# Altium schematic sheet FPGA_POWER_AND_CONFIGURATION.SchDoc: FPGA Configuration
size B; Engineer: M. Jones; Organization: Michael Jones; DocumentNumber: 3; Revision: RA.1; SheetNumber: 3; SheetTotal: 7
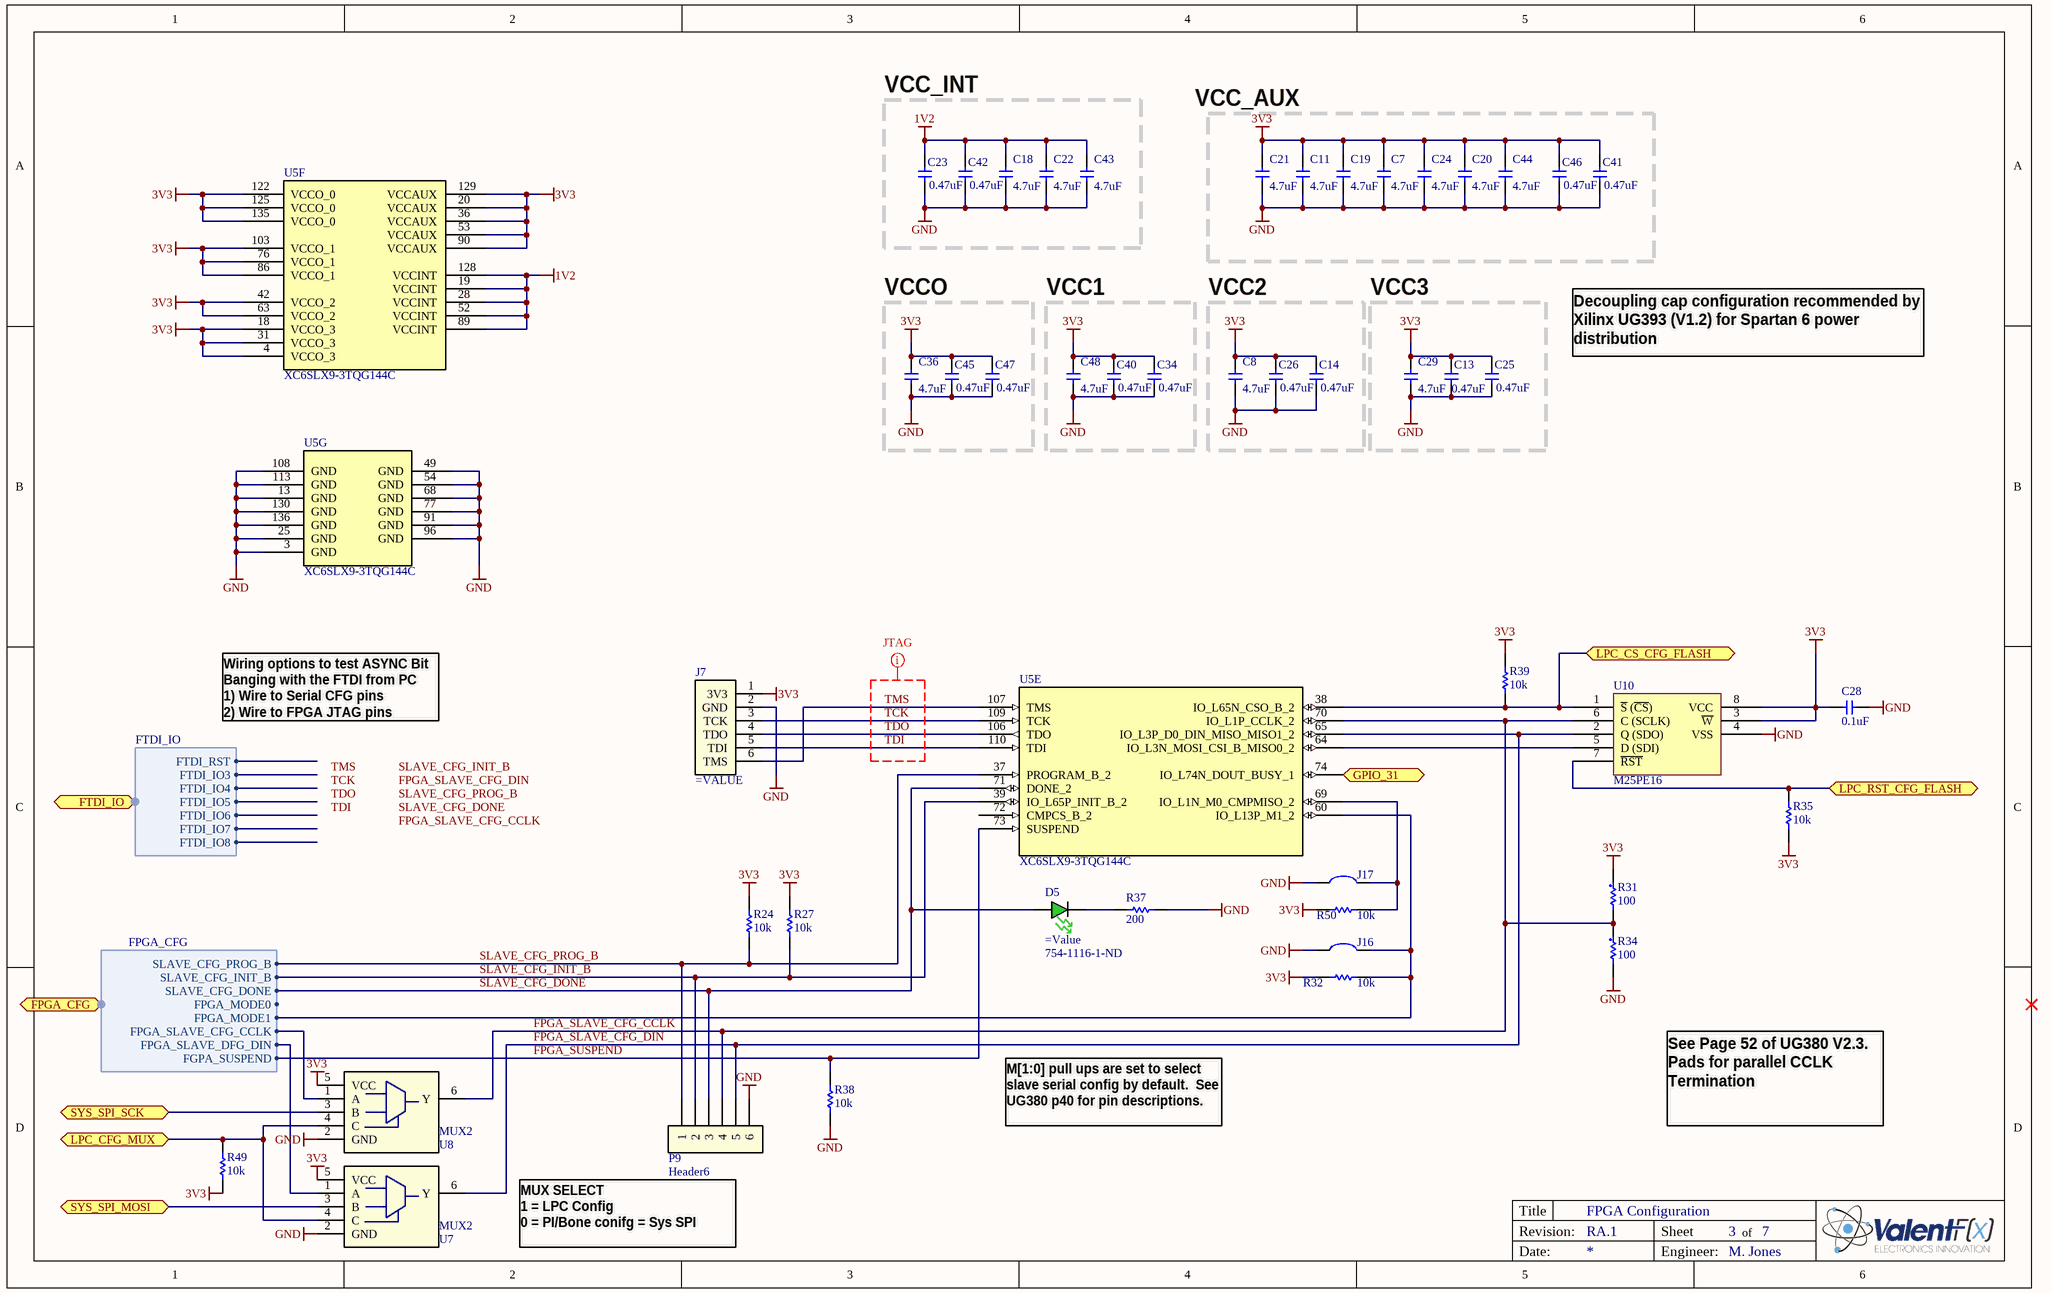
[diagram p0: FPGA_POWER_AND_CONFIGURATION.SchDoc]

## Parts
C7  4.7uF  [C0603]
C8  4.7uF  [C0603]
C11  4.7uF  [C0603]
C13  0.47uF  [C0603]
C14  0.47uF  [C0603]
C18  4.7uF  [C0603]
C19  4.7uF  [C0603]
C20  4.7uF  [C0603]
C21  4.7uF  [C0603]
C22  4.7uF  [C0603]
C23  0.47uF  [C0603]
C24  4.7uF  [C0603]
C25  0.47uF  [C0603]
C26  0.47uF  [C0603]
C28  0.1uF  [C0603]
C29  4.7uF  [C0603]
C34  0.47uF  [C0603]
C36  4.7uF  [C0603]
C40  0.47uF  [C0603]
C41  0.47uF  [C0603]
C42  0.47uF  [C0603]
C43  4.7uF  [C0603]
C44  4.7uF  [C0603]
C45  0.47uF  [C0603]
C46  0.47uF  [C0603]
C47  0.47uF  [C0603]
C48  4.7uF  [C0603]
D5  Supplier Part Number 1: 754-1116-1-ND  [LED_0603 - GREEN]
J7  (no value)  [JTAG - Digilent HS1]
J16  Solder Jumper  [SOLDER_JUMPER]  (value not drawn)  (no BOM)
J17  Solder Jumper  [SOLDER_JUMPER]  (value not drawn)  (no BOM)
P9  Header6  [HEADER_6_30_100 SMT SIP]
R24  10k  [R0603]
R27  10k  [R0603]
R31  100  [R0603]
R32  10k  [R0603]
R34  100  [R0603]
R35  10k  [R0603]
R37  200  [R0603]
R38  10k  [R0603]
R39  10k  [R0603]
R49  10k  [R0603]
R50  10k  [R0603]
U5  XC6SLX9-3TQG144C  [TQ144_L]  (parts E,F,G of 7)
U7  MUX2  [SC70-6]
U8  MUX2  [SC70-6]
U10  M25PE16  [SOIC127P830X200-8L]

## Blocks framed on the sheet
VCC_INT: C18 C22 C23 C42 C43
VCCO: C36 C45 C47
VCC1: C34 C40 C48
VCC2: C8 C14 C26
VCC3: C13 C25 C29

## Ports
FPGA_CFG (harness FPGA_CFG), FTDI_IO (harness FTDI_IO), GPIO_31, LPC_CFG_MUX, LPC_CS_CFG_FLASH, LPC_RST_CFG_FLASH, SYS_SPI_MOSI, SYS_SPI_SCK

## Harnesses
FPGA_CFG: SLAVE_CFG_PROG_B, SLAVE_CFG_INIT_B, SLAVE_CFG_DONE, FPGA_MODE0, FPGA_MODE1, FPGA_SLAVE_CFG_CCLK, FPGA_SLAVE_DFG_DIN, FGPA_SUSPEND
FTDI_IO: FTDI_IO3, FTDI_IO4, FTDI_IO5, FTDI_IO6, FTDI_IO7, FTDI_IO8, FTDI_RST

## Nets
1V2: C18.2 C22.2 C23.2 C42.2 C43.2 U5.19(VCCINT) U5.28(VCCINT) U5.52(VCCINT) U5.89(VCCINT) U5.128(VCCINT)
3V3: C7.2 C8.2 C11.2 C13.2 C14.2 C19.2 C20.2 C21.2 C24.2 C25.2 C26.2 C28.1 C29.2 C34.2 C36.2 C40.2 C41.2 C44.2 C45.2 C46.2 C47.2 C48.2 J7.1(3V3) R24.2 R27.2 R31.1 R32.1 R35.2 R39.2 R49.1 R50.1 U5.4(VCCO_3) U5.18(VCCO_3) U5.20(VCCAUX) U5.31(VCCO_3) U5.36(VCCAUX) U5.42(VCCO_2) U5.53(VCCAUX) U5.63(VCCO_2) U5.76(VCCO_1) U5.86(VCCO_1) U5.90(VCCAUX) U5.103(VCCO_1) U5.122(VCCO_0) U5.125(VCCO_0) U5.129(VCCAUX) U5.135(VCCO_0) U7.5(VCC) U8.5(VCC) U10.3(~{W}) U10.8(VCC)
GND: C7.1 C8.1 C11.1 C13.1 C14.1 C18.1 C19.1 C20.1 C21.1 C22.1 C23.1 C24.1 C25.1 C26.1 C28.2 C29.1 C34.1 C36.1 C40.1 C41.1 C42.1 C43.1 C44.1 C45.1 C46.1 C47.1 C48.1 J7.2(GND) J16.2 J17.2 P9.6 R34.2 R37.2 R38.1 U5.3(GND) U5.13(GND) U5.25(GND) U5.49(GND) U5.54(GND) U5.68(GND) U5.77(GND) U5.91(GND) U5.96(GND) U5.108(GND) U5.113(GND) U5.130(GND) U5.136(GND) U7.2(GND) U8.2(GND) U10.4(VSS)
FPGA_SLAVE_CFG_CCLK: P9.4 R31.2 R34.1 U5.70(IO_L1P_CCLK_2) U8.6(Y) U10.6(C_(SCLK))
FPGA_SLAVE_CFG_DIN: P9.5 U5.65(IO_L3P_D0_DIN_MISO_MISO1_2) U7.6(Y) U10.2(Q_(SDO))
FPGA_SUSPEND: R38.2 U5.73(SUSPEND) ; port FPGA_CFG.FGPA_SUSPEND
GPIO_31: U5.74(IO_L74N_DOUT_BUSY_1) ; port GPIO_31
LPC_CFG_MUX: R49.2 U7.4(C) U8.4(C) ; port LPC_CFG_MUX
LPC_CS_CFG_FLASH: R39.1 U5.38(IO_L65N_CSO_B_2) U10.1(~{S}_(~{CS})) ; port LPC_CS_CFG_FLASH
LPC_RST_CFG_FLASH: R35.1 U10.7(~{RST}) ; port LPC_RST_CFG_FLASH
SLAVE_CFG_DONE: D5.A P9.3 U5.71(DONE_2) ; port FPGA_CFG.SLAVE_CFG_DONE
SLAVE_CFG_INIT_B: P9.2 R27.1 U5.39(IO_L65P_INIT_B_2) ; port FPGA_CFG.SLAVE_CFG_INIT_B
SLAVE_CFG_PROG_B: P9.1 R24.1 U5.37(PROGRAM_B_2) ; port FPGA_CFG.SLAVE_CFG_PROG_B
SYS_SPI_MOSI: U7.3(B) ; port SYS_SPI_MOSI
SYS_SPI_SCK: U8.3(B) ; port SYS_SPI_SCK
TCK: J7.3(TCK) U5.109(TCK)
TDI: J7.5(TDI) U5.110(TDI)
TDO: J7.4(TDO) U5.106(TDO)
TMS: J7.6(TMS) U5.107(TMS)
NetD5_C: D5.C R37.1
NetJ16_1: J16.1 R32.2 U5.60(IO_L13P_M1_2) ; port FPGA_CFG.FPGA_MODE1
NetJ17_1: J17.1 R50.2 U5.69(IO_L1N_M0_CMPMISO_2)
NetU5_64: U5.64(IO_L3N_MOSI_CSI_B_MISO0_2) U10.5(D_(SDI))
NetU7_1: U7.1(A) ; port FPGA_CFG.FPGA_SLAVE_DFG_DIN
NetU8_1: U8.1(A) ; port FPGA_CFG.FPGA_SLAVE_CFG_CCLK

Not connected (* = marked no-connect by the designer): U5 72(CMPCS_B_2)

## Layout directives
net class JTAG: TCK, TDI, TDO, TMS

## Notes on the sheet
- VCC_AUX
- Decoupling cap configuration recommended by Xilinx UG393 (V1.2) for Spartan 6 power distribution
- Wiring options to test ASYNC Bit Banging with the FTDI from PC
  1) Wire to Serial CFG pins
  2) Wire to FPGA JTAG pins
- M[1:0] pull ups are set to select slave serial config by default.  See UG380 p40 for pin descriptions.
- See Page 52 of UG380 V2.3.   Pads for parallel CCLK Termination
- MUX SELECT
  1 = LPC Config
  0 = PI/Bone conifg = Sys SPI
- Labels drawn without touching a wire or pin: FPGA_SLAVE_CFG_CCLK, FPGA_SLAVE_CFG_DIN, SLAVE_CFG_DONE, SLAVE_CFG_INIT_B, SLAVE_CFG_PROG_B, TCK, TDI, TDO, TMS
- Title
- Revision:
- Sheet
- of
- Date:
- Engineer:

## Library data of the parts
C7 C8 C11 C18-C22 C24 C29 C36 C43 C44 C48 = GRM188R60J475KE19D: CAP CER 4.7UF 6.3V X5R 0603; Manufacturer: Murata Electronics North America; Capacitance: 4.7µF; Tolerance: ±10%; Supplier 1: Digi-Key; Supplier Part Number 1: 490-3297-1-ND; Manufacturer Part Number: GRM188R60J475KE19D; RoHS: RoHS Compliant; Category: Capacitors; Stock 1: 714091; Pricing 1: 10=0.214, 50=0.148, 100=0.1142, 250=0.08204, 500=0.0585, 1000=0.04281 (USD); Voltage - Rated: 6.3V; Temperature Coefficient: X5R; Mounting Type: Surface Mount, MLCC; Operating Temperature: -55°C ~ 85°C; Applications: General Purpose; Ratings: -; Package / Case: 0603 (1608 Metric); Size / Dimension: 0.063" L x 0.031" W (1.60mm x 0.80mm); Height: -; Thickness: 0.035" (0.90mm); Lead Spacing: -; Features: -; Packaging: Cut Tape (CT); Lead Style: -; ComponentLink1URL: http://search.murata.co.jp/Ceramy/image/img/PDF/ENG/GRM188R60J475KE19.pdf; ComponentLink1Description: http://search.murata.co.jp/Ceramy/image/img/PDF/ENG/GRM188R60J475KE19.pdf; Value: 4.7uF
C13 C14 C23 C25 C26 C34 C40-C42 C45-C47 = GCM188R71E474KA64D: CAP CER .47UF 25V X7R 0603; Manufacturer: Murata Electronics North America; Capacitance: 0.47µF; Tolerance: ±10%; Supplier 1: Digi-Key; Supplier Part Number 1: 490-4776-1-ND; Manufacturer Part Number: GCM188R71E474KA64D; RoHS: RoHS Compliant; Category: Capacitors; Stock 1: 120782; Pricing 1: 10=0.248, 50=0.1444, 100=0.1155, 250=0.08252, 500=0.0561, 1000=0.04538 (USD); Voltage - Rated: 25V; Temperature Coefficient: X7R; Mounting Type: Surface Mount, MLCC; Operating Temperature: -55°C ~ 125°C; Applications: Automotive; Ratings: AEC-Q200; Package / Case: 0603 (1608 Metric); Size / Dimension: 0.063" L x 0.031" W (1.60mm x 0.80mm); Height: -; Thickness: 0.035" (0.90mm); Lead Spacing: -; Features: -; Packaging: Cut Tape (CT); Lead Style: -; ComponentLink1URL: http://search.murata.co.jp/Ceramy/image/img/PDF/ENG/GCM188R71E474KA64.pdf; ComponentLink1Description: http://search.murata.co.jp/Ceramy/image/img/PDF/ENG/GCM188R71E474KA64.pdf; Value: 0.47uF
C28 = GRM188R71H104KA93D: CAP CER .1UF 50V 10% X7R 0603; Manufacturer: Murata Electronics North America; Capacitance: 0.1µF; Manufacturer Part Number: GRM188R71H104KA93D; Value: CAP CER .1UF 50V 10% X7R 0603; Supplier 1: Digi-Key; Supplier Part Number 1: 490-1519-1-ND; RoHS: RoHS Compliant; Category: Capacitors; Stock 1: 9370695; Pricing 1: 10=0.037, 100=0.0221, 500=0.01276, 1000=0.00884 (USD); Voltage - Rated: 50V; Tolerance: ±10%; Temperature Coefficient: X7R; Mounting Type: Surface Mount, MLCC; Operating Temperature: -55°C ~ 125°C; Features: -; Applications: General Purpose; Ratings: -; Package / Case: 0603 (1608 Metric); Size / Dimension: 0.063" L x 0.031" W (1.60mm x 0.80mm); Lead Spacing: -; Thickness: 0.80mm; Packaging: Cut Tape (CT); Lead Style: -; ComponentLink1URL: http://search.murata.co.jp/Ceramy/image/img/PDF/ENG/GRM188R71H104KA93.pdf; ComponentLink1Description: http://search.murata.co.jp/Ceramy/image/img/PDF/ENG/GRM188R71H104KA93.pdf
D5 = APT1608CGCK: LED 1.6X0.8MM 570NM GRN CLR SMD; Manufacturer: Kingbright Corp; Color: Green; Current - Test: 20mA; Wavelength - Peak: 574nm; Millicandela Rating: 50mcd; Voltage - Forward (Vf) Typ: 2.1V; Lens Type: Clear; Lens Style/Size: Rectangle with Flat Top, 1.2mm x 0.8mm; Viewing Angle: 120°; Supplier 1: Digi-Key; Manufacturer Part Number: APT1608CGCK; RoHS: RoHS Compliant; Category: Optoelectronics; Stock 1: 98122; Pricing 1: 1=0.2, 10=0.153, 25=0.1224, 100=0.1105, 250=0.102, 500=0.0918 (USD); Luminous Flux @ Current - Test: -; Wavelength - Dominant: 570nm; Size / Dimension: 1.60mm L x 0.80mm W; Height: 0.75mm; Package / Case: 0603 (1608 Metric); Mounting Type: Surface Mount; Packaging: Cut Tape (CT); ComponentLink1URL: http://www.us.kingbright.com/images/catalog/SPEC/APT1608CGCK.pdf; ComponentLink1Description: http://www.us.kingbright.com/images/catalog/SPEC/APT1608CGCK.pdf
J7 = JTAG - Digilent HS1: DIGILENT - 410-205 - PROGRAMMING CABLE, JTAG HS1, USB2; Manufacturer: Samtec; Manufacturer Part Number: TSW-106-08-G-S-RA; Description: Conn Unshrouded Header HDR 6 POS 2.54mm Solder RA Thru-Hole; Lead Time: 0 weeks; Peak Solder Temperature: 260 deg C; MSL Level Min: N/R; Connector Type: Header, Unshrouded; Number of Positions: 6; Number of Positions Loaded: All; Pitch: 0.100" (2.54mm); Supplier 1: Arrow; RoHS: CHINA ROHS: Compliant / EU ROHS: Compliant; Stock 1: 0; Pricing 1: 0=0.2649 (USD); ComponentLink1URL: http://components.arrow.com/partservice/dataview/altium/2677508S3639200N1004?apiKey=aa438727d59eed98c4bed826d8d949c84cb5e685b92bf87346a0226bd2658797; ComponentLink1Description: http://components.arrow.com/partservice/dataview/altium/2677508S3639200N1004?apiKey=aa438727d59eed98c4bed826d8d949c84cb5e685b92bf87346a0226bd2658797; Supplier Part Number 1: 2677508S3639200N1004; Package Quantity: 1; Termination Finish: Au/Ni; MSL Level Max: N/R; MSL (Moisture Sensitivity Level): N/R; China ROHS Lead (X -> above / O -> below threshold): O; China ROHS Mercury (X -> above / O -> below threshold): O; China ROHS Cadmium (X -> above / O -> below threshold): O; China ROHS Hex Chromium (X -> above / O -> below threshold): O; China ROHS PBB (X -> above / O -> below threshold): O; China ROHS PBDE (X -> above / O -> below threshold): O; EU_ROHS_PROD_EXEMPTION_BY_SUPP: N/R; Supplier 2: Digi-Key; Category: Connectors, Interconnects; Stock 2: 0; Pricing 2: 1=0.94, 10=0.841, 100=0.6926, 500=0.5475, 1000=0.46999, 5000=0.42877, 10000=0.41228 (USD); Contact Type: Male Pin; Number of Rows: 1; Row Spacing: -; Contact Mating Length: 0.230" (5.84mm); Mounting Type: Through Hole; Termination: Solder; Fastening Type: -; Features: -; Contact Finish: Gold; Contact Finish Thickness: 10µin (0.25µm); Color: Black; Packaging: Bulk; ComponentLink2URL: http://www.samtec.com/documents/webfiles/cpdf/TSW-XXX-XX-XXX-X-XX-XXX-MKT.pdf; ComponentLink2Description: http://www.samtec.com/documents/webfiles/cpdf/TSW-XXX-XX-XXX-X-XX-XXX-MKT.pdf; Supplier Part Number 2: SAM1038-06-ND
J16 J17 = Solder Jumper: Solder/Configuration Jumper; Manufacturer: n/a; Manufacturer Part Number: n/a; Source: n/a; Source Part Number: n/a; ROHS Certificate: n/a
P9 = Header6: Header 6 pin
R24 R27 R32 R35 R38 R39 R49 R50 = ERJ-3EKF1002V: RES 10.0K OHM 1/10W 1% 0603 SMD; Manufacturer: Panasonic - ECG; Power (Watts): 0.1W, 1/10W; Temperature Coefficient: ±100ppm/°C; Manufacturer Part Number: ERJ-3EKF1002V; Value: 10k; Supplier 1: Digi-Key; RoHS: RoHS Compliant; Category: Resistors; Stock 1: 11168880; Pricing 1: 1=0.04, 50=0.015, 100=0.0114, 250=0.00844, 500=0.00624, 1000=0.00416 (USD); Resistance (Ohms): 10.0K; Composition: Thick Film; Features: -; Tolerance: ±1%; Size / Dimension: 0.063" L x 0.031" W (1.60mm x 0.80mm); Height: 0.018" (0.45mm); Lead Style: Surface Mount (SMD - SMT); Packaging: Cut Tape (CT); Package / Case: 0603 (1608 Metric); ComponentLink1URL: http://industrial.panasonic.com/www-cgi/jvcr13pz.cgi?E+PZ+3+AOA0002+ERJ3EKF1002V+7+WW; ComponentLink1Description: http://industrial.panasonic.com/www-cgi/jvcr13pz.cgi?E+PZ+3+AOA0002+ERJ3EKF1002V+7+WW; Supplier Part Number 1: P10.0KHCT-ND
R31 R34 = R0603 - CRCW0603100RFKEA: 100 ohms 1% Thick Film Resistors - SMD 1/10watt; Manufacturer: Vishay/Dale; Description: Thick Film Resistors - SMD 1/10watt 100ohms 1%; Power Rating: 0.1 Watt (1/10 Watt); Temperature Coefficient: 100 PPM / K; Voltage Rating: 75 Volts; Supplier 1: Mouser; Manufacturer Part Number: CRCW0603100RFKEA; RoHS: RoHS Compliant By Exemption; Category: Thick Film Resistors - SMD; Stock 1: 243353; Pricing 1: 1=0.108, 25=0.054, 100=0.034, 1000=0.020, 2000=0.018, 5000=0.008, 10000=0.007, 50000=0.005 (AUD); Dimensions: 0.85 mm W x 1.55 mm L x 0.45 mm H; Operating Temperature Range: - 55 C to + 155 C; Package / Case: 0603 (1608 metric); Packaging: Reel; Product: Thick Film Resistors SMD; Resistance: 100 Ohms; Series: CRCW; Termination Style: SMD/SMT; Tolerance: 1 %; Product Category: 0603 Thick Film Chip Resistors; Standard Pack Qty: 5000; RoHS - Mouser: E; Minimum Order Quantity: 1; Reeling: True; ComponentLink1URL: http://www.vishay.com/doc?20035; ComponentLink1Description: http://www.vishay.com/doc?20035; Supplier Part Number 1: 71-CRCW0603-100-E3; Value: 100
R37 = ERJ-3EKF2000V: RES 200 OHM 1/10W 1% 0603 SMD; Manufacturer: Panasonic - ECG; Power (Watts): 0.1W, 1/10W; Temperature Coefficient: ±100ppm/°C; Manufacturer Part Number: ERJ-3EKF2000V; Value: RES 200 OHM 1/10W 1% 0603 SMD; Supplier 1: Digi-Key; Supplier Part Number 1: P200HCT-ND; RoHS: RoHS Compliant; Category: Resistors; Stock 1: 1279595; Pricing 1: 1=0.04, 50=0.015, 100=0.0114, 250=0.00844, 500=0.00624, 1000=0.00416 (USD); Resistance (Ohms): 200; Composition: Thick Film; Features: -; Tolerance: ±1%; Size / Dimension: 0.063" L x 0.031" W (1.60mm x 0.80mm); Height: 0.018" (0.45mm); Lead Style: Surface Mount (SMD - SMT); Packaging: Cut Tape (CT); Package / Case: 0603 (1608 Metric); ComponentLink1URL: http://industrial.panasonic.com/www-cgi/jvcr13pz.cgi?E+PZ+3+AOA0002+ERJ3EKF2000V+7+WW; ComponentLink1Description: http://industrial.panasonic.com/www-cgi/jvcr13pz.cgi?E+PZ+3+AOA0002+ERJ3EKF2000V+7+WW
U5 = XC6SLX9-3TQG144C: IC FPAG SPARTAN 6 9K 144TQFP; Manufacturer: Xilinx Inc; Number of Logic Elements/Cells: 9152; Number of LABs/CLBs: 715; Total RAM Bits: 589824; Number of I /O: 102; Voltage - Supply: 1.14 V ~ 1.26 V; Supplier 1: Digi-Key; Supplier Part Number 1: 122-1747-ND; Manufacturer Part Number: XC6SLX9-3TQG144C; RoHS: RoHS Compliant; Category: Integrated Circuits (ICs); Stock 1: 77; Pricing 1: 1=17.22 (USD); Number of Gates: -; Mounting Type: Surface Mount; Operating Temperature: 0°C ~ 85°C; Package / Case: 144-LQFP; Supplier Device Package: 144-TQFP (20x20); ComponentLink1URL: http://www.xilinx.com/support/documentation/data_sheets/ds160.pdf; ComponentLink1Description: http://www.xilinx.com/support/documentation/data_sheets/ds160.pdf; Value: XC6SLX9-3TQG144C
U7 U8 = MUX - SN74AUP1T157DCKR: IC BUFF/MUX SCHMITT-TRIG SC70-6; Manufacturer: Texas Instruments; Circuit: 1 x 3:1; Independent Circuits: 1; Current - Output High, Low: 4mA, 4mA; Voltage Supply Source: Single Supply; Voltage - Supply: 2.3 V ~ 3.6 V; Supplier 1: Digi-Key; Manufacturer Part Number: SN74AUP1T157DCKR; RoHS: RoHS Compliant; Category: Integrated Circuits (ICs); Stock 1: 1261; Pricing 1: 1=0.4, 10=0.315, 25=0.266, 100=0.2166, 250=0.1794, 500=0.1482, 1000=0.111 (USD); Type: Multiplexer; Operating Temperature: -40°C ~ 85°C; Mounting Type: Surface Mount; Package / Case: 6-TSSOP, SC-88, SOT-363; Supplier Device Package: SC-70-6; Packaging: Cut Tape (CT); ComponentLink1URL: http://www.ti.com/lit/ds/symlink/sn74aup1t157.pdf; ComponentLink1Description: http://www.ti.com/lit/ds/symlink/sn74aup1t157.pdf; Supplier Part Number 1: 296-27393-1-ND; Value: MUX2
U10 = M25PE16-VMW6TG: IC FLASH 16MBIT 75MHZ 8SOIC; Manufacturer: Numonyx/ST Micro; Memory Size: 16M (2M x 8); Interface: SPI, 3-Wire Serial; Voltage - Supply: 2.7 V ~ 3.6 V; Supplier 1: Digi-Key; Manufacturer Part Number: M25PE16-VMW6TG; RoHS: RoHS Compliant; Category: Integrated Circuits (ICs); Stock 1: 866; Pricing 1: 1=2.31, 10=1.98, 25=1.782, 100=1.617, 250=1.452, 500=1.254 (USD); Format - Memory: FLASH; Memory Type: FLASH; Speed: 75MHz; Operating Temperature: -40°C ~ 85°C; Package / Case: 8-SOIC (0.200", 5.30mm Width); Packaging: Cut Tape (CT); Supplier Device Package: *; ComponentLink1URL: http://www.numonyx.com/Documents/Datasheets/M25PE16.pdf; ComponentLink1Description: http://www.numonyx.com/Documents/Datasheets/M25PE16.pdf; Supplier Part Number 1: M25PE16-VMW6TGCT-ND; Value: M25PE16